# Altium schematic sheet LCD.SchDoc
size A
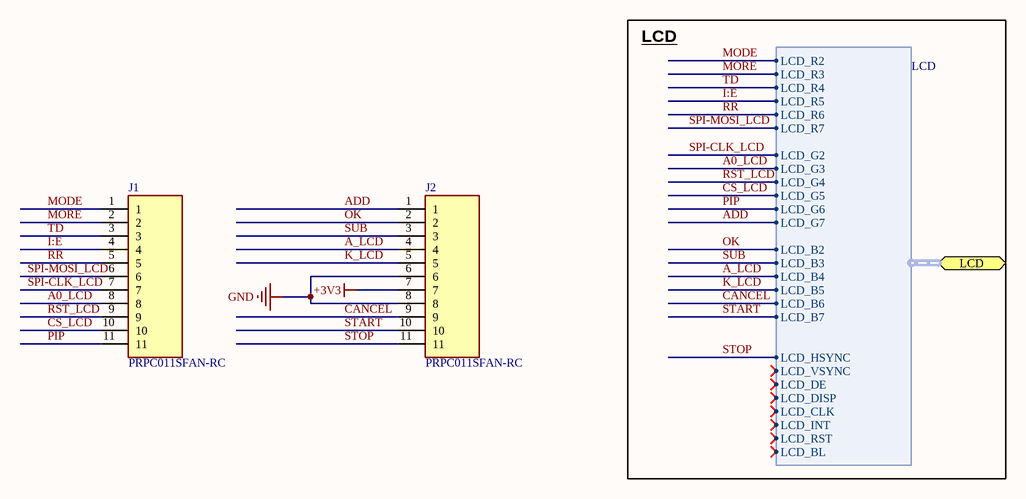
[diagram p0: LCD.SchDoc]

## Parts
J1  PRPC011SFAN-RC  [1N4148]
J2  PRPC011SFAN-RC  [HDRV11W64P254_1X11_2794X254X1058P]

## Ports
LCD (harness LCD)

## Harnesses
LCD: LCD_R2, LCD_G2, LCD_B2, LCD_HSYNC, LCD_VSYNC, LCD_DE, LCD_DISP, LCD_CLK, LCD_INT, LCD_BL, LCD_RST, LCD_R3, LCD_R4, LCD_R5, LCD_R6, LCD_R7, LCD_G3, LCD_G4, LCD_G5, LCD_G6, LCD_G7, LCD_B3, LCD_B4, LCD_B5, LCD_B6, LCD_B7

## Nets
+3V3: J2.7
GND: J2.6 J2.8
A0_LCD: J1.8 ; port LCD.LCD_G3
A_LCD: J2.4 ; port LCD.LCD_B4
ADD: J2.1 ; port LCD.LCD_G7
CANCEL: J2.9 ; port LCD.LCD_B6
CS_LCD: J1.10 ; port LCD.LCD_G5
I:E: J1.4 ; port LCD.LCD_R5
K_LCD: J2.5 ; port LCD.LCD_B5
MODE: J1.1 ; port LCD.LCD_R2
MORE: J1.2 ; port LCD.LCD_R3
OK: J2.2 ; port LCD.LCD_B2
PIP: J1.11 ; port LCD.LCD_G6
RR: J1.5 ; port LCD.LCD_R6
RST_LCD: J1.9 ; port LCD.LCD_G4
SPI-CLK_LCD: J1.7 ; port LCD.LCD_G2
SPI-MOSI_LCD: J1.6 ; port LCD.LCD_R7
START: J2.10 ; port LCD.LCD_B7
STOP: J2.11 ; port LCD.LCD_HSYNC
SUB: J2.3 ; port LCD.LCD_B3
TD: J1.3 ; port LCD.LCD_R4

## Notes on the sheet
- LCD

## Library data of the parts
J1 J2 = PRPC011SFAN-RC: Connector; Manufacturer_Name: Sullins; Datasheet Link: https://media.digikey.com/PDF/Data%20Sheets/Sullins%20PDFs/xRxCzzzSxxN-RC_ST_11635-B.pdf; Height: 10.58mm; Manufacturer_Part_Number: PRPC011SFAN-RC